# EAGLE design cc2538Breakout (EAGLE 6.5.0)
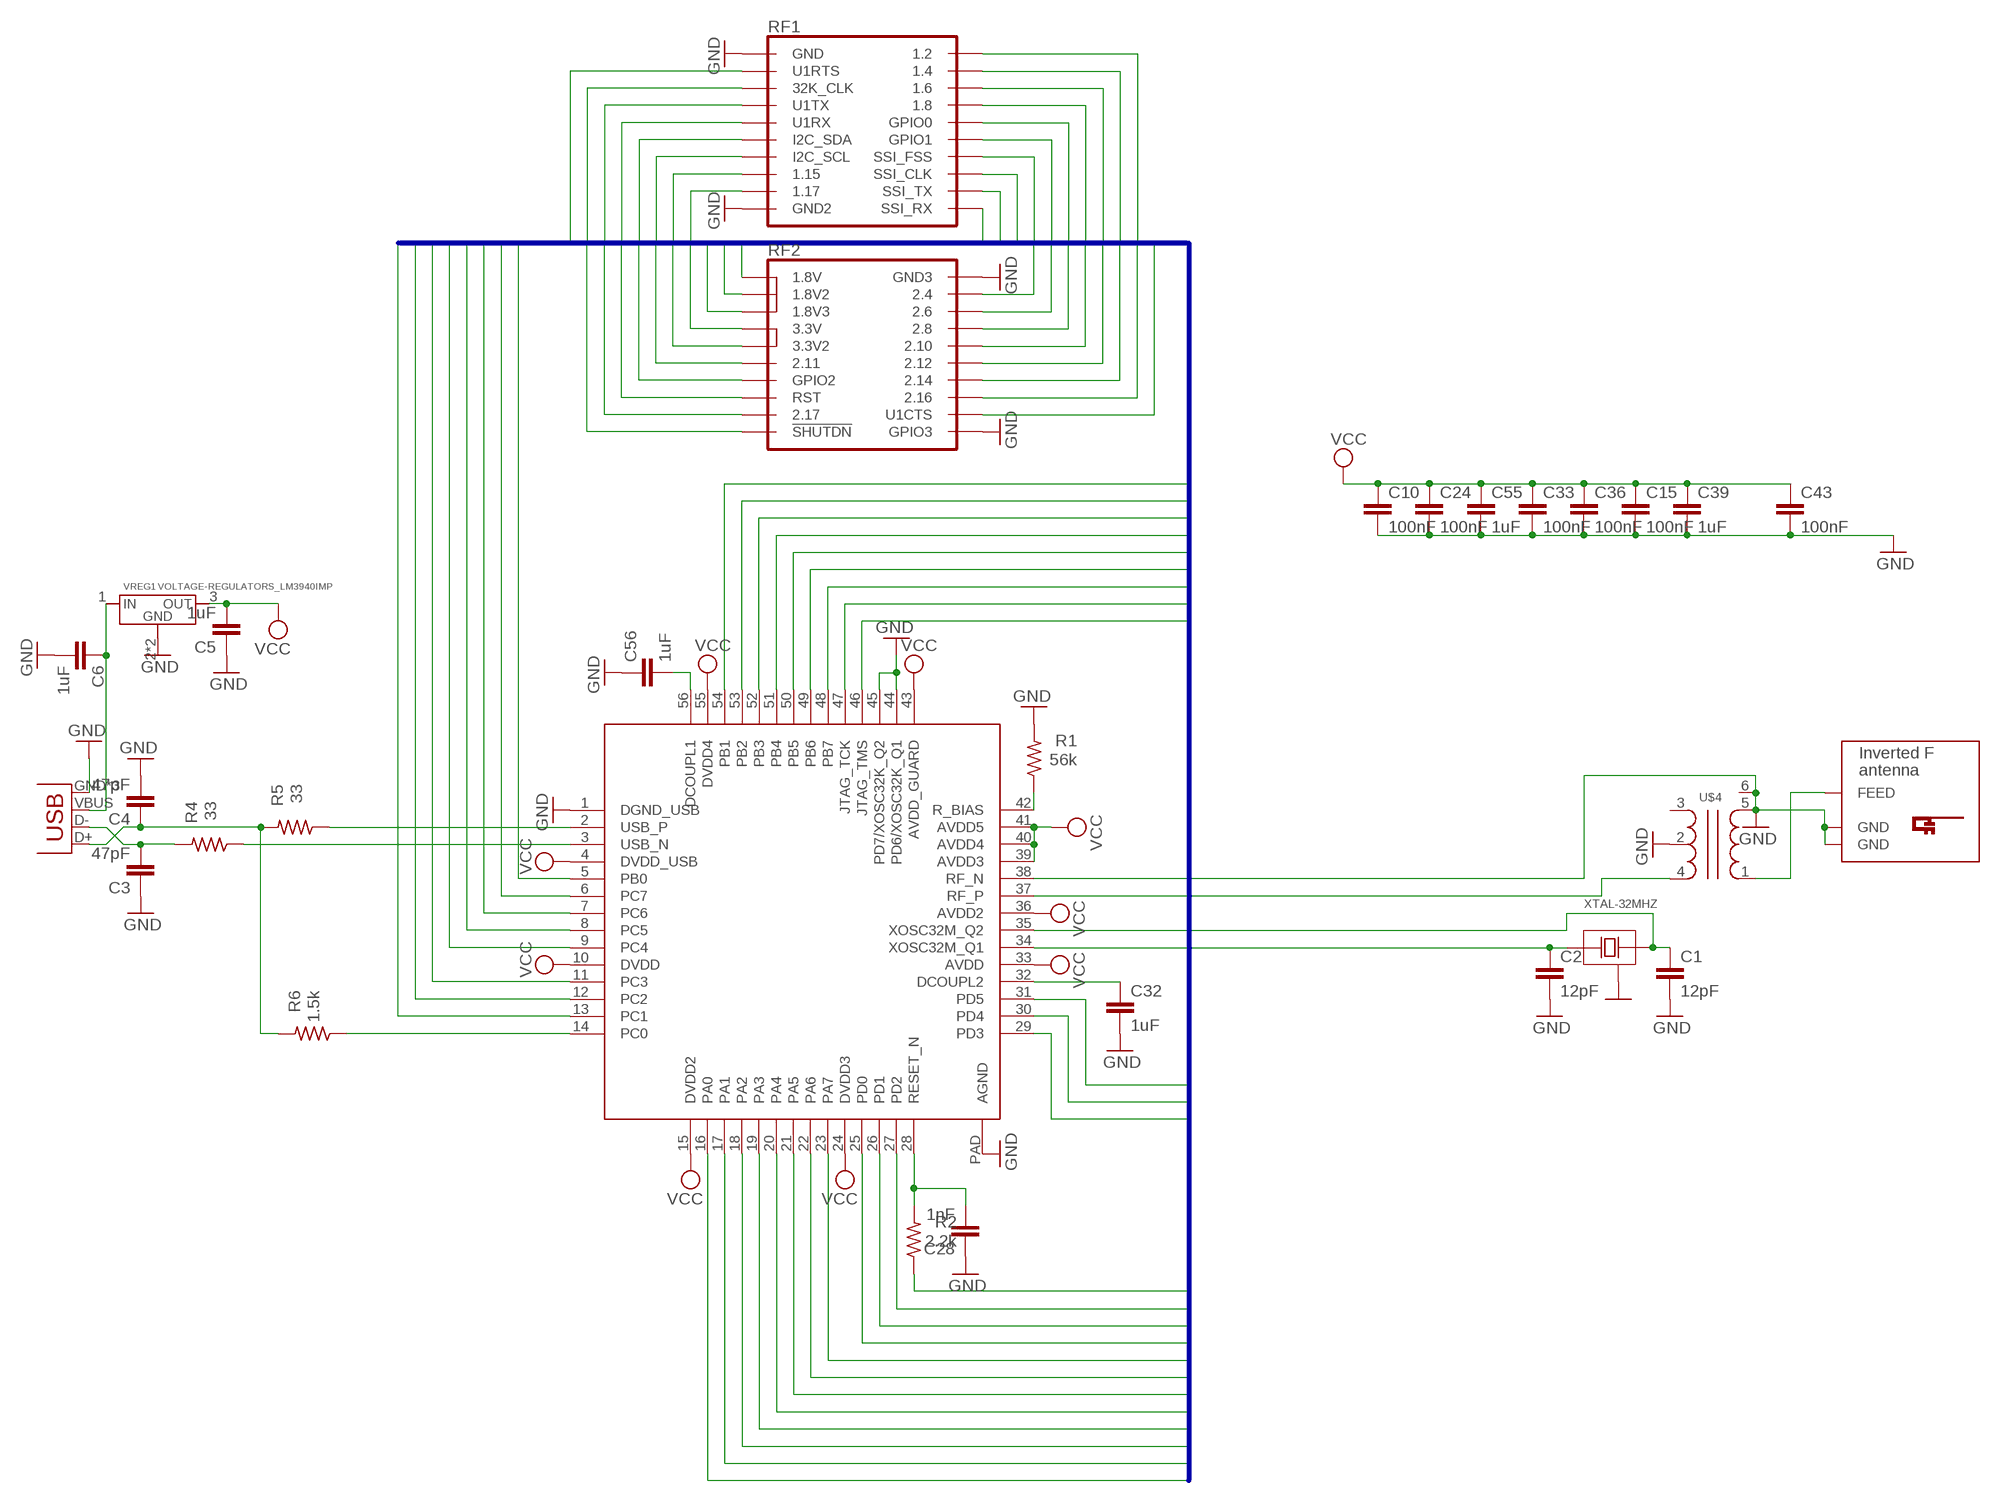
[diagram p0: schematic, sheet 1]

## Parts
C1  12pF  C-EUC0805  [C0805]
C2  12pF  C-EUC0805  [C0805]
C3  47pF  C-EUC0805  [C0805]
C4  47pF  C-EUC0805  [C0805]
C5  1uF  C-EUC0805  [C0805]
C6  1uF  C-EUC0805  [C0805]
C10  100nF  C-EUC0805  [C0805]
C15  100nF  C-EUC0805  [C0805]
C24  100nF  C-EUC0805  [C0805]
C28  1nF  C-EUC0805  [C0805]
C32  1uF  C-EUC0805  [C0805]
C33  100nF  C-EUC0805  [C0805]
C36  100nF  C-EUC0805  [C0805]
C39  1uF  C-EUC0805  [C0805]
C43  100nF  C-EUC0805  [C0805]
C55  1uF  C-EUC0805  [C0805]
C56  1uF  C-EUC0805  [C0805]
JP1  USB-MICROB  [USB-MICROB]
R1  56k  R-US_R0805  [R0805]
R2  2.2k  R-US_R0805  [R0805]
R4  33  R-US_R0805  [R0805]
R5  33  R-US_R0805  [R0805]
R6  1.5k  R-US_R0805  [R0805]
U$1  CC2538  [QFN56-EXT]
U$2  ANTENNA_INVERTED_F_ANTENNA+0  [ANTENNA_DN007+0]
U$3  STELLARIS_LAUNCHPAD_EM_HEADERS  [2_EMHEADER_TOP]
U$4  DISCRETE_BALUN  [DISCRETE_BALUN-0805]
VREG1  VOLTAGE-REGULATORS_LM3940IMP  [VOLTAGE-REGULATORS_SOT223]
XTAL-32MHZ  DISCRETE_XTAL-43225  [DISCRETE_XTAL-4-3225]

## Nets
ANT_GND: U$1.38(RF_N) U$2.GND U$2.GND@1(GND) U$4.5 U$4.6 ; supply symbol labelled GND
GND: C1.2 C2.2 C3.1 C4.2 C5.1 C6.2 C10.2 C15.2 C24.2 C28.1 C32.2 C33.2 C36.2 C39.2 C43.2 C55.2 C56.1 JP1.GND JP1.MT1(GND) JP1.MT2(GND) R1.2 U$1.1(DGND_USB) U$1.44(PD6/XOSC32K_Q1) U$1.45(PD7/XOSC32K_Q2) U$1.PAD(AGND) U$3.1(GND) U$3.19(GND2) U$3.22(GND3) U$3.40(GPIO3) U$4.2 VREG1.2(GND) VREG1.4(GND) XTAL-32MHZ.2(GND1) XTAL-32MHZ.4(GND1) ; supply symbol labelled SUPPLY1_GND
I/O2: U$1.12(PC2) U$3.2(1.2)
I/O3: U$1.5(PB0) U$3.3(U1RTS)
I/O4: U$1.11(PC3) U$3.4(1.4)
I/O5: U$1.54(PB1) U$3.5(32K_CLK)
I/O6: U$1.9(PC4) U$3.6(1.6)
I/O7: U$1.16(PA0) U$3.7(U1TX)
I/O8: U$1.8(PC5) U$3.8(1.8)
I/O9: U$1.17(PA1) U$3.9(U1RX)
I/O10: U$1.7(PC6) U$3.10(GPIO0)
I/O11: U$1.53(PB2) U$3.11(I2C_SDA)
I/O12: U$1.6(PC7) U$3.12(GPIO1)
I/O13: U$1.52(PB3) U$3.13(I2C_SCL)
I/O14: U$1.19(PA3) U$3.14(SSI_FSS)
I/O15: U$1.51(PB4) U$3.15(1.15)
I/O16: U$1.18(PA2) U$3.16(SSI_CLK)
I/O17: U$1.50(PB5) U$3.17(1.17)
I/O18: U$1.20(PA4) U$3.18(SSI_TX)
I/O20: U$1.21(PA5) U$3.20(SSI_RX)
I/O21: U$1.47(JTAG_TCK) U$3.21(1.8V)
I/O23: U$3.23(1.8V2)
I/O24: U$1.46(JTAG_TMS) U$3.24(2.4)
I/O25: U$1.22(PA6) U$3.25(1.8V3)
I/O26: U$1.23(PA7) U$3.26(2.6)
I/O27: U$3.27(3.3V)
I/O28: U$1.30(PD4) U$3.28(2.8)
I/O29: U$3.29(3.3V2)
I/O30: U$1.31(PD5) U$3.30(2.10)
I/O31: U$3.31(2.11)
I/O32: U$1.25(PD0) U$3.32(2.12)
I/O33: U$1.13(PC1) U$3.33(GPIO2)
I/O34: U$1.26(PD1) U$3.34(2.14)
I/O35: R2.1 U$3.35(RST)
I/O36: U$1.27(PD2) U$3.36(2.16)
I/O37: U$1.49(PB6) U$3.37(2.17)
I/O38: U$1.29(PD3) U$3.38(U1CTS)
I/O39: U$1.48(PB7) U$3.39(!SHUTDN)
N$1: C2.1 U$1.34(XOSC32M_Q1) XTAL-32MHZ.1(X1)
N$2: U$2.FEED U$4.1
N$5: U$1.37(RF_P) U$4.4
N$10: C56.2 U$1.56(DCOUPL1)
N$11: C32.1 U$1.32(DCOUPL2)
N$13: R1.1 U$1.42(R_BIAS)
N$14: C28.2 R2.2 U$1.28(RESET_N)
N$30: R6.1 U$1.14(PC0)
N$38: R5.1 U$1.2(USB_P)
N$41: C3.2 JP1.D- R4.2
N$42: C4.1 JP1.D+ R5.2 R6.2
N$43: R4.1 U$1.3(USB_N)
N$45: C6.1 JP1.VBUS VREG1.1(IN)
VCC: C5.2 C10.1 C15.1 C24.1 C33.1 C36.1 C39.1 C43.1 C55.1 U$1.4(DVDD_USB) U$1.10(DVDD) U$1.15(DVDD2) U$1.24(DVDD3) U$1.33(AVDD) U$1.36(AVDD2) U$1.39(AVDD3) U$1.40(AVDD4) U$1.41(AVDD5) U$1.43(AVDD_GUARD) U$1.55(DVDD4) VREG1.3(OUT)
XOSC32N_Q2: C1.1 U$1.35(XOSC32M_Q2) XTAL-32MHZ.3(X2)
Unconnected: U$4.3

## Buses
I/O[1..40]

## Library data of the parts
C1-C6 C10 C15 C24 C28 C32 C33 C36 C39 C43 C55 C56 = resistor:C-EU: CAPACITOR, European symbol
JP1 = SparkFun-Connectors:USB: USB Connectors USB-B-PTH is fully proven SKU : PRT-00139/CONN-08278 USB-miniB is fully proven SKU : PRT-00587 USB-A-PCB is untested. USB-A-H is throughly reviewed, but untested. Spark Fun Electronics SKU : PRT-00437 USB-B-SMT is throughly reviewed, but untested. Needs silkscreen touching up. USB-A-S has not been used/tested USB-MB-H has not been used/tested USB-MICROB has been used. CONN-09505; PROD_ID: CONN-09505
R1 R2 R4-R6 = resistor:R-US_: RESISTOR, American symbol
U$1 = cc2538ext:CC2538
U$2 = PCB 3.0.0:ANTENNA_INVERTED_F_ANTENNA: 2.4GHz Inverted F Antenna Based on TI Design Note DN007
U$3 = AustinBlackstoneEngineeringPublic:STELLARIS_LAUNCHPAD_EM_HEADERS: EM Headers for Stellaris Launchpads. This device is the skyward facing part. (traditionally the femals part) The part that goes on top of this is samtec
U$4 = PCB 3.0.0:DISCRETE_BALUN
VREG1 = PCB 3.0.0:VOLTAGE-REGULATORS_LM3940
XTAL-32MHZ = PCB 3.0.0:DISCRETE_XTAL-4

## Board
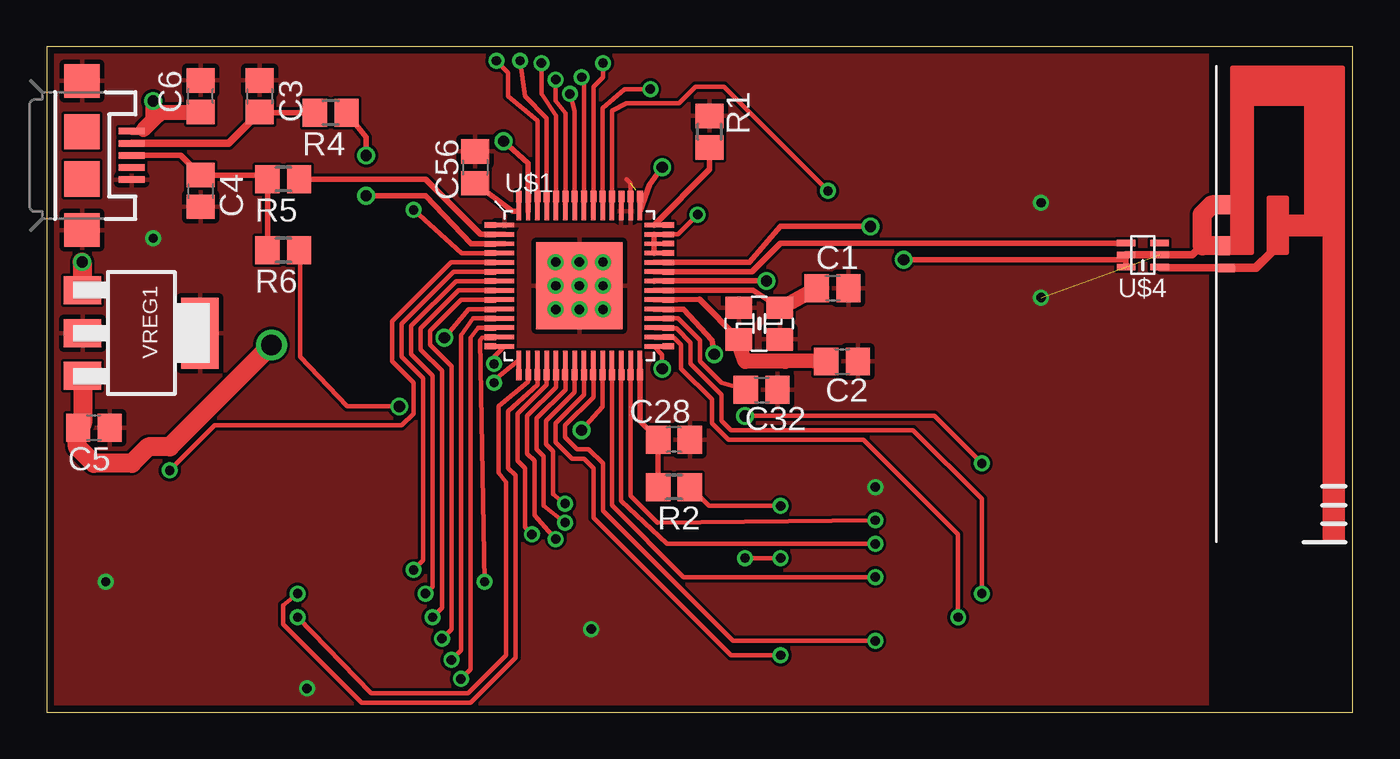
[diagram p1: board, top side]
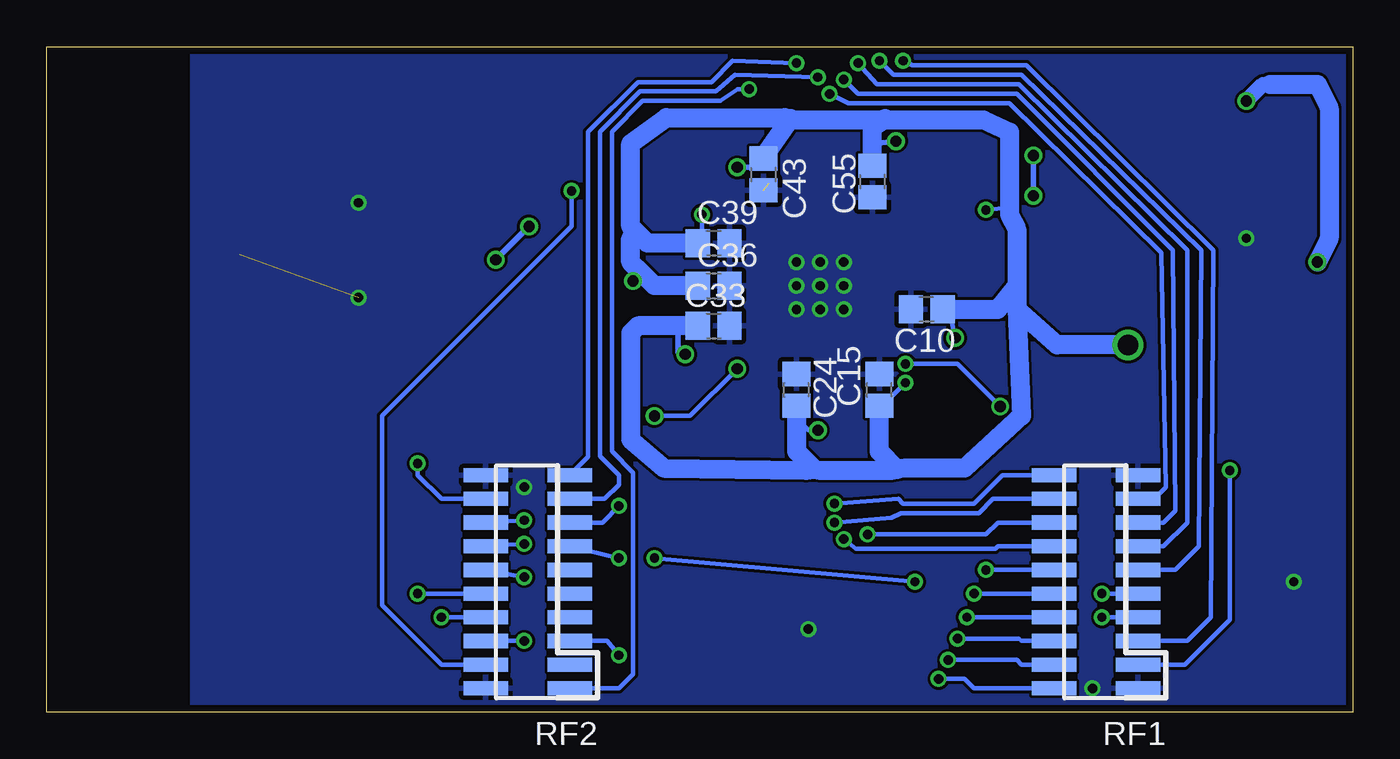
[diagram p2: board, bottom side, seen from below]

Size 70.07 x 35.68 mm. Coordinates in mm from the lower left corner, seen from the top.
Outline: 0,0 70.07,0 70.07,35.68 0,35.68 0,0
Copper layers (1*16): Top 0.0356mm / dielectric 1.5011mm / Bottom 0.0356mm
Design rules "LaenPCBOrder": minimum track width 6mil, minimum drill 13mil, track to track 6mil, track to pad 6mil, pad to pad 6mil, via to via 6mil, smd to smd 6mil, copper to edge 15mil, drill to drill 6mil, minimum pad ring 7mil, minimum via ring 7mil, stop-mask expansion 3mil, vias tented up to drill 0mil, thermal gap 10mil

### Footprints (pad centres in the part's own frame; a part is rotated, then mirrored left to right if it is on the bottom)
C0805 = smd 1.3 x 1.5: 1 -0.85,0; 2 0.85,0
USB-MICROB = smd 0.35 x 1.4: D+ 0,2.65; D- -0.65,2.65; GND 1.3,2.65; ID 0.65,2.65; VBUS -1.3,2.65 | smd 1.8 x 1.9: MT1 -4,0; MT2 4,0 | smd 1.9 x 1.9: P$1 -1.27,0; P$2 1.27,0
R0805 = smd 1.3 x 1.5: 1 -0.85,0; 2 0.85,0
QFN56-EXT = smd 1 x 0.24: 1 -4,3.25; 2 -4,2.75; 3 -4,2.25; 4 -4,1.75; 5 -4,1.25; 6 -4,0.75; 7 -4,0.25; 8 -4,-0.25; 9 -4,-0.75; 10 -4,-1.25; 11 -4,-1.75; 12 -4,-2.25; 13 -4,-2.75; 14 -4,-3.25; 29 4,-3.25; 30 4,-2.75; 31 4,-2.25; 32 4,-1.75; 33 4,-1.25; 34 4,-0.75; 35 4,-0.25; 36 4,0.25; 37 4,0.75; 38 4,1.25; 39 4,1.75; 40 4,2.25; 41 4,2.75; 42 4,3.25 | smd 0.24 x 1: 15 -3.25,-4; 16 -2.75,-4; 17 -2.25,-4; 18 -1.75,-4; 19 -1.25,-4; 20 -0.75,-4; 21 -0.25,-4; 22 0.25,-4; 23 0.75,-4; 24 1.25,-4; 25 1.75,-4; 26 2.25,-4; 27 2.75,-4; 28 3.25,-4; 43 3.25,4; 44 2.75,4; 45 2.25,4; 46 1.75,4; 47 1.25,4; 48 0.75,4; 49 0.25,4; 50 -0.25,4; 51 -0.75,4; 52 -1.25,4; 53 -1.75,4; 54 -2.25,4; 55 -2.75,4; 56 -3.25,4 | smd 0.61 x 0.305: P$1 -4.775,3.251; P$2 -4.775,2.743; P$3 -4.775,2.235; P$4 -4.775,1.753; P$5 -4.775,1.245; P$6 -4.775,0.737; P$7 -4.775,0.254; P$8 -4.775,-0.254; P$9 -4.775,-0.762; P$10 -4.775,-1.27; P$11 -4.775,-1.753; P$12 -4.775,-2.261; P$13 -4.775,-2.769; P$14 -4.775,-3.251; P$29 4.775,3.251; P$30 4.775,2.743; P$31 4.775,2.261; P$32 4.775,1.753; P$33 4.775,1.245; P$34 4.775,0.737; P$35 4.775,0.254; P$36 4.775,-0.254; P$37 4.775,-0.762; P$38 4.775,-1.27; P$39 4.775,-1.753; P$40 4.775,-2.261; P$41 4.775,-2.743; P$42 4.775,-3.251 | smd 0.305 x 0.61: P$15 -3.251,4.775; P$16 -2.743,4.775; P$17 -2.235,4.775; P$18 -1.753,4.775; P$19 -1.245,4.775; P$20 -0.737,4.775; P$21 -0.254,4.775; P$22 0.254,4.775; P$23 0.762,4.775; P$24 1.245,4.775; P$25 1.753,4.775; P$26 2.261,4.775; P$27 2.743,4.775; P$28 3.251,4.775; P$43 -3.251,-4.775; P$44 -2.743,-4.775; P$45 -2.261,-4.775; P$46 -1.753,-4.775; P$47 -1.245,-4.775; P$48 -0.762,-4.775; P$49 -0.254,-4.775; P$50 0.254,-4.775; P$51 0.737,-4.775; P$52 1.245,-4.775; P$53 1.753,-4.775; P$54 2.261,-4.775; P$55 2.743,-4.775; P$56 3.251,-4.775 | smd 4.65 x 4.65: PAD 0,0
ANTENNA_DN007+0 = smd 0.46 x 1: FEED 2.22,-2.8 | smd 1.01 x 0.74: GND -1.16,-2.93; GND@1 1.035,-2.93
2_EMHEADER_TOP = smd 2.4 x 0.76: 1 -0.537,12.192; 2 3.966,12.192; 3 -0.537,10.922; 4 3.966,10.922; 5 -0.537,9.652; 6 3.966,9.652; 7 -0.537,8.382; 8 3.966,8.382; 9 -0.537,7.112; 10 3.966,7.112; 11 -0.537,5.842; 12 3.966,5.842; 13 -0.537,4.572; 14 3.966,4.572; 15 -0.537,3.302; 16 3.966,3.302; 17 -0.537,2.032; 18 3.966,2.032; 19 -0.537,0.762; 20 3.966,0.762; 21 29.943,12.192; 22 34.446,12.192; 23 29.943,10.922; 24 34.446,10.922; 25 29.943,9.652; 26 34.446,9.652; 27 29.943,8.382; 28 34.446,8.382; 29 29.943,7.112; 30 34.446,7.112; 31 29.943,5.842; 32 34.446,5.842; 33 29.943,4.572; 34 34.446,4.572; 35 29.943,3.302; 36 34.446,3.302; 37 29.943,2.032; 38 34.446,2.032; 39 29.943,0.762; 40 34.446,0.762
DISCRETE_BALUN-0805 = smd 1 x 0.35: 1 -0.9,0.65; 2 -0.9,0; 3 -0.9,-0.65; 4 0.9,-0.65; 5 0.9,0; 6 0.9,0.65
VOLTAGE-REGULATORS_SOT223 = smd 1.5 x 2: 1 -2.3,-3.15; 2 0,-3.15; 3 2.3,-3.15 | smd 3.8 x 2: 4 0,3.15
DISCRETE_XTAL-4-3225 = smd 1.4 x 1.2: 1 -1.1,-0.85; 2 1.1,-0.85; 3 1.1,0.85; 4 -1.1,0.85

### Placement (x,y rotation side)
C1  42.16,22.73 0 top
C2  42.67,18.8 0 top
C3  11.43,33.02 270 top
C4  8.26,27.94 270 top
C5  2.54,15.24 180 top
C6  8.26,33.02 90 top
C10  22.86,21.59 180 bottom
C15  25.4,17.27 90 bottom
C24  29.84,17.27 90 bottom
C28  33.66,14.61 180 top
C32  38.35,17.27 0 top
C33  34.29,20.7 0 bottom
C36  34.29,22.86 0 bottom
C39  34.29,25.15 0 bottom
C43  31.62,28.83 270 bottom
C55  25.78,28.45 270 bottom
C56  22.99,29.21 270 top
JP1  1.91,29.84 270 top
R1  35.56,31.11 90 top
R2  33.66,12.06 180 top
R4  15.24,32.13 180 top
R5  12.7,28.57 180 top
R6  12.7,24.77 180 top
U$1  28.57,22.86 0 top
U$2  66.04,26.04 270 top
U$3  12.06,13.46 180 bottom
U$4  58.8,24.51 180 top
VREG1  5.08,20.32 270 top
XTAL-32MHZ  38.23,20.83 0 top

### Tracks (layer width: path | path; a pad name or v marks a point on that pad's centre or on a via)
ANT_GND  (via drill 0.6)
  Top 0.305: U$1.38 37.7,24.11 39.37,26.04 v44.2,26.04 | v45.97,24.26 57.89,24.26 | 57.89,24.26 U$4.6 | 57.89,24.26 57.89,24.5 U$4.5
  Top 0.406: U$4.5 61.47,24.51 61.98,25.02
  Top 1.016: U$2.GND@1 61.99,25 61.98,25.02 61.98,26.67 62.5,27.2 U$2.GND
  Bottom 0.305: v44.2,26.04 v45.97,24.26
GND  (via drill 0.5)  (2 unrouted)
  Top 0.254: U$1.44 31.32,28.36 31.11,28.57
  other vias: 28.57,22.86 27.3,24.13 27.3,22.86 27.3,21.59 28.57,21.59 29.84,21.59 29.84,22.86 29.84,24.13 28.57,24.13 53.34,27.3 53.34,22.23 29.21,4.45 44.45,12.06 13.97,1.27 5.71,25.4 3.17,6.99
  pour Top: 0,35.56 62.23,35.56 62.23,0 0,0
  pour Bottom: 17.78,32.38 38.73,32.38 38.73,12.7 17.78,12.7
  pour Bottom: 0,35.56 62.23,35.56 62.23,0 0,0
I/O2  (via drill 0.5)
  Top 0.254: U$1.12 23.15,20.61 22.73,20.07 22.73,2.29 v22.23,1.78
  Bottom 0.254: v22.23,1.78 20.83,1.78 20.32,1.27 U$3.2
I/O3  (via drill 0.5)
  Top 0.254: U$1.5 21.7,24.11 18.54,20.95 18.54,18.8 19.68,17.65 19.68,16 19.05,15.37 9.02,15.37 v6.6,12.95
  Bottom 0.254: v6.6,12.95 6.6,4.95 9.02,2.54 U$3.3
I/O4  (via drill 0.5)
  Top 0.254: U$1.11 22.89,21.11 22.23,20.19 22.23,3.3 v21.72,2.79
  Bottom 0.254: v21.72,2.79 18.03,2.79 17.78,2.54 U$3.4
I/O5  (via drill 0.5 pad 0.25)
  Top 0.254: U$1.54 26.32,31.71 24.77,33.02 24.77,34.29 v24.13,34.92
  Bottom 0.254: v24.13,34.92 23.62,34.67 17.53,34.67 7.49,24.77 7.62,5.08 8.89,3.81 U$3.5
I/O6  (via drill 0.5)
  Top 0.254: U$1.9 22.24,22.11 20.57,20.45 20.57,19.68 21.72,18.54 21.72,4.45 v21.21,3.94
  Bottom 0.254: v21.21,3.94 17.91,3.94 17.78,3.81 U$3.6
I/O7  (via drill 0.5)
  Top 0.254: U$1.16 25.82,17.7 24.26,16.38 24.26,12.83 24.64,12.32 24.64,3.05 22.61,1.02 17.4,1.02 v13.46,5.08
  Bottom 0.254: v13.46,5.08 U$3.7
I/O8  (via drill 0.5)
  Top 0.254: U$1.8 22.1,22.61 20.07,20.57 20.07,19.43 21.21,18.29 21.21,5.59 v20.7,5.08
  Bottom 0.254: v20.7,5.08 U$3.8
I/O9  (via drill 0.5)
  Top 0.254: U$1.17 26.32,17.56 24.77,16.13 24.77,13.08 25.15,12.7 25.15,2.92 22.73,0.51 16.89,0.51 12.7,4.7 12.7,5.71 v13.46,6.35
  Bottom 0.254: v13.46,6.35 U$3.9
I/O10  (via drill 0.5)
  Top 0.254: U$1.7 21.97,23.11 19.56,20.7 19.56,19.18 20.7,18.03 20.7,6.73 v20.32,6.35
  Bottom 0.254: v20.32,6.35 U$3.10
I/O11  (via drill 0.5 pad 0.25)
  Top 0.254: U$1.53 26.82,31.85 25.65,33.02 v25.4,34.92
  Bottom 0.254: v25.4,34.92 24.64,34.16 17.78,34.16 8.13,24.77 8.26,8.89 9.53,7.62 U$3.11
I/O12  (via drill 0.5)
  Top 0.254: U$1.6 21.83,23.61 19.05,20.83 19.05,19.05 20.19,17.91 20.19,8.13 v19.68,7.62
  Bottom 0.254: v19.68,7.62 U$3.12
I/O13  (via drill 0.5 pad 0.25)
  Top 0.254: U$1.52 27.32,31.98 26.54,33.15 v26.54,34.8
  Bottom 0.254: v26.54,34.8 25.53,33.66 17.91,33.66 8.89,24.77 8.89,10.16 10.16,8.89 U$3.13
I/O14  (via drill 0.5)
  Top 0.254: U$1.19 27.32,17.42 25.78,15.88 25.78,13.84 26.16,13.46 26.16,10.54 v27.3,9.27
  Bottom 0.254: v27.3,9.27 26.67,8.76 19.18,8.76 19.05,8.89 U$3.14
I/O15  (via drill 0.5 pad 0.25)
  Top 0.254: U$1.51 27.82,32.12 27.3,32.77 v27.3,33.91
  Bottom 0.254: v27.3,33.91 26.54,33.15 18.03,33.15 9.65,24.77 9.53,10.79 10.16,10.16 U$3.15
I/O16  (via drill 0.5)
  Top 0.254: U$1.18 26.82,17.55 25.27,16 25.27,13.46 25.65,13.08 25.65,9.91 v26.04,9.53
  Bottom 0.254: v26.04,9.53 19.68,9.53 19.05,10.16 U$3.16
I/O17  (via drill 0.5 pad 0.25)
  Top 0.254: U$1.50 28.32,32.25 v28.07,33.15
  Bottom 0.254: U$3.17 10.79,11.3 10.03,12.06 10.29,24.64 18.41,32.64 27.05,32.64 v28.07,33.15
I/O18  (via drill 0.5)
  Top 0.254: U$1.20 27.82,17.28 26.29,15.75 26.29,14.1 26.67,13.72 26.67,11.05 v27.81,10.16
  Bottom 0.254: v27.81,10.16 24.77,10.41 24.26,10.67 20.07,10.67 19.3,11.43 U$3.18
I/O20  (via drill 0.5)
  Top 0.254: U$1.21 28.32,17.14 26.8,15.62 26.8,14.35 27.18,13.97 27.18,11.68 v27.81,11.18
  Bottom 0.254: v27.81,11.18 24.38,11.43 24.13,11.18 20.32,11.18 18.8,12.7 U$3.20
I/O21  (via drill 0.5 pad 0.25)
  Top 0.254: U$1.47 29.82,32.37 30.99,33.4 v32.38,33.4
  Bottom 0.254: v32.38,33.4 33.02,33.4 33.91,32.77 38.1,32.77 39.75,31.11 39.75,13.97 38.61,12.83 38.61,2.03 39.37,1.27 U$3.21
I/O24  (via drill 0.5)
  Top 0.254: U$1.46 30.32,32.23 31.11,32.64 33.91,32.64 34.8,33.53 36.32,33.53 v41.91,27.94
  Bottom 0.254: v41.91,27.94 41.91,26.04 52.07,15.88 52.07,5.71 48.9,2.54 U$3.24
I/O25  (via drill 0.5)
  Top 0.254: U$1.22 28.82,17.01 27.3,15.49 27.3,14.48 28.19,13.59 28.83,13.59 29.34,13.08 29.34,10.41 36.7,3.05 v39.37,3.05
  Bottom 0.254: v39.37,3.05 40.01,3.81 U$3.25
I/O26  (via drill 0.5)
  Top 0.254: U$1.23 29.32,16.88 27.81,15.37 27.81,14.73 28.45,14.1 29.08,14.1 29.84,13.34 29.84,10.79 36.83,3.81 v44.45,3.81
  Bottom 0.254: v44.45,3.81 U$3.26
I/O28  (via drill 0.5)
  Top 0.254: U$1.30 32.62,20.07 33.66,20.07 34.04,19.68 34.04,18.41 35.69,16.76 35.69,15.49 36.58,14.61 43.81,14.61 48.9,9.53 v48.9,5.08
  Bottom 0.254: v48.9,5.08 U$3.28
I/O30  (via drill 0.5)
  Top 0.254: U$1.31 32.61,20.57 33.78,20.57 34.54,19.81 34.54,18.67 36.2,17.02 36.2,15.62 36.7,15.11 46.48,15.11 50.16,11.43 v50.16,6.35
  Bottom 0.254: v50.16,6.35 U$3.30
I/O32  (via drill 0.5)
  Top 0.254: U$1.25 30.32,11.08 34.16,7.24 v44.45,7.24
  Bottom 0.254: v44.45,7.24 U$3.32
I/O33  (via drill 0.5)
  Top 0.254: U$1.13 23.37,20.07 23.24,19.94 v23.5,6.99 | v37.47,8.26 v39.37,8.26
  Bottom 0.254: v23.5,6.99 v37.47,8.26 | v39.37,8.26 U$3.33
I/O34  (via drill 0.5)
  Top 0.254: U$1.26 30.82,11.34 33.27,9.02 v44.45,9.02
  Bottom 0.254: v44.45,9.02 U$3.34
I/O35  (via drill 0.5)
  Top 0.254: R2.1 35.52,11.05 v39.37,11.05
  Bottom 0.254: v39.37,11.05 40.26,10.16 U$3.35
I/O36  (via drill 0.5)
  Top 0.254: U$1.27 31.32,11.6 32.77,10.16 v44.45,10.29
  Bottom 0.254: v44.45,10.29 U$3.36
I/O37  (via drill 0.5 pad 0.25)
  Top 0.254: U$1.49 28.82,33.91 v28.7,34.04
  Bottom 0.254: v28.7,34.04 33.15,34.16 34.16,33.27 38.23,33.27 40.39,31.11 40.39,13.72 39.37,12.7 39.37,12.19 40.13,11.43 U$3.37
I/O38  (via drill 0.5, 0.6)
  Top 0.254: U$1.29 33.02,19.16 v33.02,18.41 | v37.47,15.88 47.62,15.88 v50.16,13.34
  Bottom 0.254: v33.02,18.41 35.56,15.88 v37.47,15.88 | v50.16,13.34 50.16,12.7 48.9,11.43 U$3.38
I/O39  (via drill 0.5 pad 0.25)
  Top 0.254: U$1.48 29.32,33.52 29.84,34.04 v29.84,34.8
  Bottom 0.254: v29.84,34.8 33.27,34.92 34.42,33.78 38.35,33.78 41.02,31.11 41.02,13.69 U$3.39
N$1
  Top 0.305: XTAL-32MHZ.1 35.01,22.14 33.78,22.1 32.59,22.1 U$1.34
  Top 0.813: C2.1 41.19,18.84 39.62,18.8 37.47,18.8 37.08,19.89 XTAL-32MHZ.1
N$2
  Top 0.406: U$2.FEED 59.75,23.82 U$4.1
N$5
  Top 0.305: U$1.37 37.83,23.61 39.37,25.15 57.89,25.15 U$4.4
N$10
  Top 0.305: U$1.56 25,26.86 C56.2
N$11
  Top 0.254: U$1.32 33.88,21.11 35.05,19.94 35.05,18.8 36.2,17.65 C32.1
N$13
  Top 0.305: U$1.42 35.56,29.09 R1.1
N$14
  Top 0.305: R2.2 C28.2 31.82,15.59 U$1.28
N$30  (via drill 0.5, 0.6)
  Top 0.254: v18.92,16.38 16.13,16.38 13.59,19.05 13.59,24.42 R6.1 | v24,18.67 24,19.04 U$1.14
  Bottom 0.254: v18.92,16.38 21.21,18.67 v24,18.67
N$38
  Top 0.305: U$1.2 23.29,25.61 20.32,28.57 R5.1
N$41
  Top 0.305: R4.2 11.47,32.13 C3.2
  Top 0.406: JP1.D- 9.76,30.5 C3.2
N$42
  Top 0.305: JP1.D+ 7.2,29.84 C4.1 11.63,28.79 R5.2 R6.2
N$43  (via drill 0.6)
  Top 0.305: U$1.3 22.77,25.11 20.32,27.69 v17.14,27.69 | v17.14,29.84 17.14,30.82 R4.1
  Bottom 0.305: v17.14,27.69 v17.14,29.84
N$45  (via drill 0.6)
  Top 0.406: JP1.VBUS 5.11,31.14 5.21,31.24
  Top 0.813: 5.71,31.75 6.13,32.17 C6.1 | 5.21,31.24 5.71,31.75 | 5.71,31.75 v5.71,32.77
  Top 1.016: v1.91,24.13 1.91,22.64 VREG1.1
  Bottom 0.813: v5.71,32.77 4.83,33.66 4.45,33.66
  Bottom 1.016: 4.45,33.66 1.91,33.66 1.27,32.38 1.27,25.4 v1.91,24.13
VCC  (via drill 0.5, 0.6, 1.1)
  Top 0.254: U$1.24 29.82,16.36 v28.7,15.11 | U$1.10 22.63,21.61 v21.34,20.07 | v24,17.65 23.99,17.78 U$1.15 | U$1.4 22.25,24.61 v19.68,26.92 | U$1.41 33.87,25.61 v34.92,26.67
  Top 0.305: U$1.39 U$1.40 U$1.41 | U$1.55 25.82,29.42 v24.51,30.61 | U$1.43 32.33,28.27 v33.02,29.21 | U$1.36 v38.61,23.11 | U$1.33 32.59,21.59 34.16,21.59 35.69,19.94 v35.81,19.18
  Top 1.016: VREG1.3 1.93,15.48 C5.2 1.65,15.2 1.65,14.22 2.54,13.34 4.57,13.34 5.46,14.22 6.6,14.22 v12.06,19.68
  Bottom 0.254: v28.7,15.11 29.21,15.11 29.84,15.75 | v21.34,20.07 21.59,21.34 21.34,21.59 | C15.1 25.23,16.42 v24,17.65 | v19.68,26.92 18.41,27.05 | v34.92,26.67 34.92,25.36 C39.1
  Bottom 0.305: 20.32,21.72 20.19,21.59 | v24.51,30.61 25.78,30.48 | v33.02,29.21 31.08,29.21 C43.1 | v38.61,23.11 38.1,23.5 | v35.81,19.18 36.2,19.3 36.2,20.7
  Bottom 1.016: 18.03,22.86 18.03,21.59 | 18.03,21.59 17.78,15.88 20.83,13.08 24,13.08 24.45,13.02 | 24.45,13.02 25.4,13.97 C15.1 | C24.1 29.84,15.75 29.84,13.97 28.89,13.02 | 28.89,13.02 28.57,12.95 24.77,12.95 24.45,13.02 | C33.1 36.2,20.7 38.35,20.7 38.73,20.32 38.73,14.61 36.96,13.08 29.34,12.95 28.89,13.02 | C10.1 21.34,21.59 20.19,21.59 19.05,21.59 18.03,22.86 | C55.1 25.78,30.48 25.78,31.37 25.08,31.81 | 25.08,31.81 24.89,31.75 19.81,31.75 18.41,31.11 18.41,27.05 18.41,26.67 18.03,25.91 18.03,22.86 | C43.1 31.37,30.1 30.16,31.81 | 30.16,31.81 29.97,31.75 25.53,31.75 25.08,31.81 | C39.1 37.85,25.15 38.42,25.72 | 38.42,25.72 38.73,26.04 38.73,30.48 36.83,31.88 30.48,31.88 30.16,31.81 | C36.1 37.47,22.86 38.1,23.5 38.73,24.13 38.73,25.4 38.42,25.72 | v12.06,19.68 15.88,19.68 18.03,21.59
XOSC32N_Q2
  Top 0.305: XTAL-32MHZ.3 37.89,22.61 37.72,22.61 U$1.35
  Top 0.813: C1.1 39.49,21.72 XTAL-32MHZ.3